# EAGLE design Arduino-Pro-Mini (EAGLE 8.2.1)
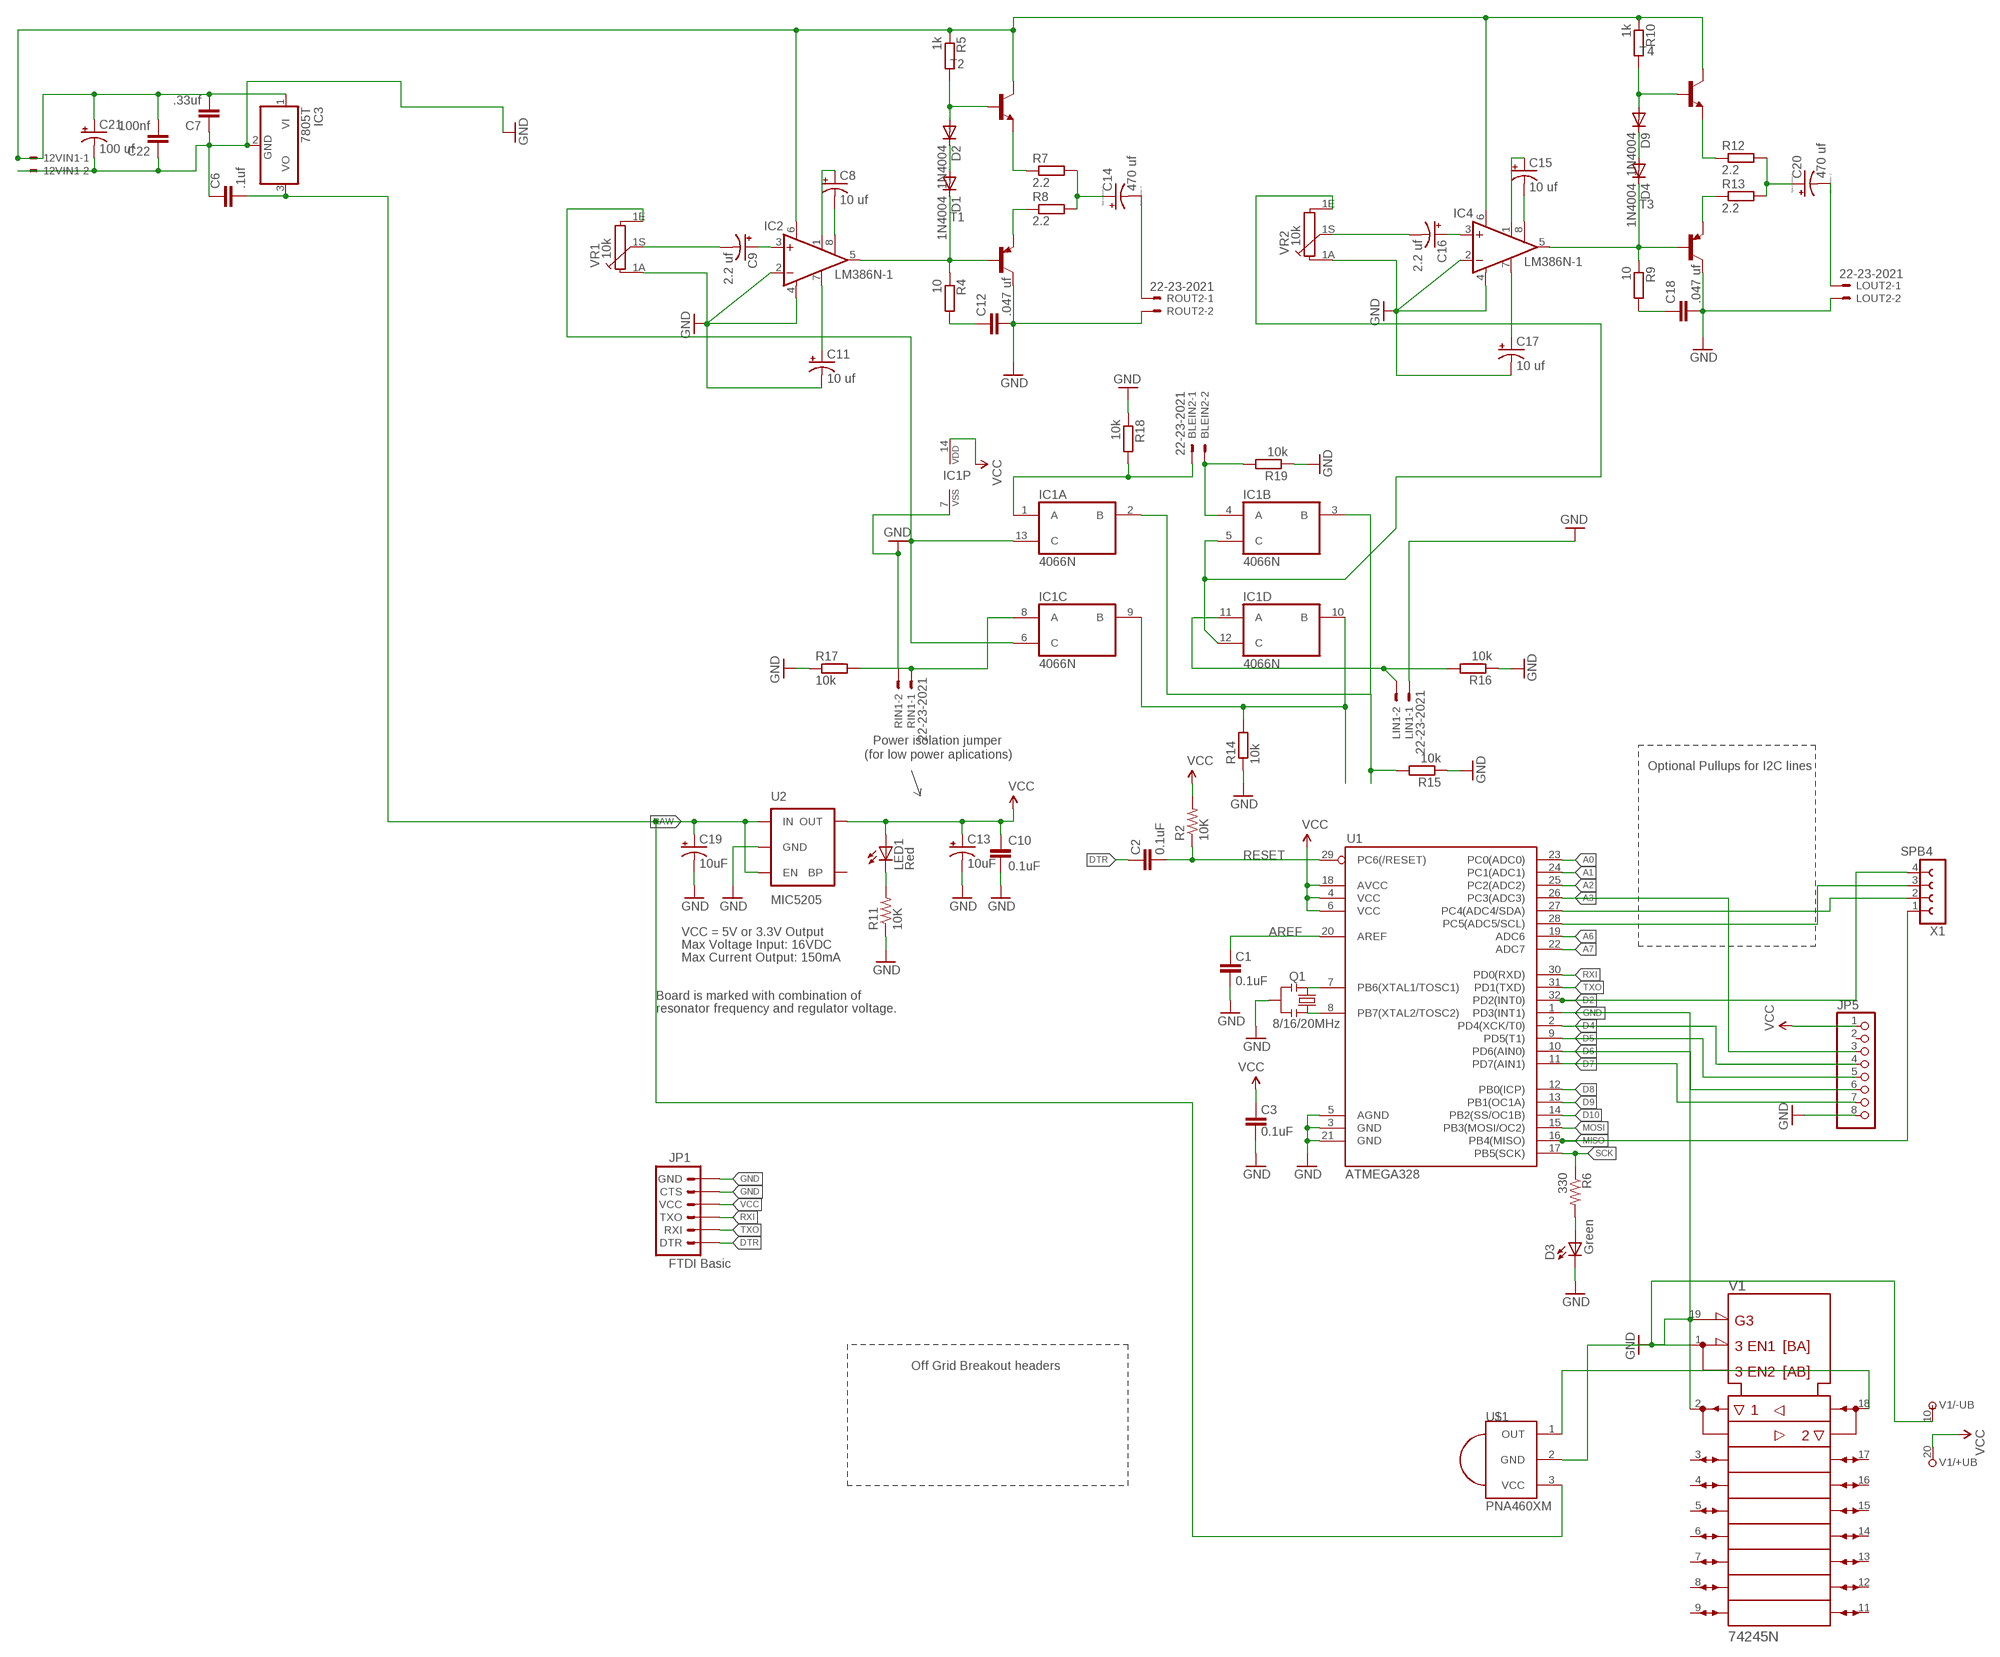
[diagram p0: schematic, sheet 1]

## Parts
12VIN1  22-23-2021  [22-23-2021]
BLEIN2  22-23-2021  [22-23-2021]
C1  0.1uF  CAPPTH1  [CAP-PTH-5MM]
C2  0.1uF  CAPPTH1  [CAP-PTH-5MM]
C3  0.1uF  CAPPTH1  [CAP-PTH-5MM]
C6  .1uf  C2.5/2  [C2.5-2]
C7  .33uf  C2.5/2  [C2.5-2]
C8  10 uf  CPOL-USE1.8-4  [E1,8-4]
C9  2.2 uf  CPOL-USE1.8-4  [E1,8-4]
C10  0.1uF  CAPPTH1  [CAP-PTH-5MM]
C11  10 uf  CPOL-USE1.8-4  [E1,8-4]
C12  .047 uf  C2.5/2  [C2.5-2]
C13  10uF  CAP_POLPTH1  [CPOL-RADIAL-100UF-25V]
C14  470 uf  CPOL-USE2,5-6E  [E2,5-6E]
C15  10 uf  CPOL-USE1.8-4  [E1,8-4]
C16  2.2 uf  CPOL-USE1.8-4  [E1,8-4]
C17  10 uf  CPOL-USE1.8-4  [E1,8-4]
C18  .047 uf  C2.5/2  [C2.5-2]
C19  10uF  CAP_POLPTH1  [CPOL-RADIAL-100UF-25V]
C20  470 uf  CPOL-USE2,5-6E  [E2,5-6E]
C21  100 uf  CPOL-USE1.8-4  [E1,8-4]
C22  100nf  C2.5/2  [C2.5-2]
D1  1N4004  [DO41-10]
D2  1N4004  [DO41-10]
D3  Green  LED5MM  [LED5MM]
D4  1N4004  [DO41-10]
D9  1N4004  [DO41-10]
IC1  4066N  [DIL14]
IC2  LM386N-1  [DIL08]
IC3  7805T  [TO220H]
IC4  LM386N-1  [DIL08]
JP1  FTDI Basic  ARDUINO_SERIAL_PROGRAMPTH  [1X06]
JP5  PINHD-1X8BIG  [1X08-BIG]
LED1  Red  LED5MM  [LED5MM]
LIN1  22-23-2021  [22-23-2021]
LOUT2  22-23-2021  [22-23-2021]
Q1  8/16/20MHz  RESONATORPTH  [RESONATOR-PTH]
R2  10K  RESISTORAXIAL-0.3  [AXIAL-0.3]
R4  10  R-EU_0204/7  [0204/7]
R5  1k  R-EU_0204/7  [0204/7]
R6  330  RESISTORAXIAL-0.3  [AXIAL-0.3]
R7  2.2  R-EU_0204/7  [0204/7]
R8  2.2  R-EU_0204/7  [0204/7]
R9  10  R-EU_0204/7  [0204/7]
R10  1k  R-EU_0204/7  [0204/7]
R11  10K  RESISTORAXIAL-0.3  [AXIAL-0.3]
R12  2.2  R-EU_0204/7  [0204/7]
R13  2.2  R-EU_0204/7  [0204/7]
R14  10k  R-EU_0204/7  [0204/7]
R15  10k  R-EU_0204/7  [0204/7]
R16  10k  R-EU_0204/7  [0204/7]
R17  10k  R-EU_0204/7  [0204/7]
R18  10k  R-EU_0204/7  [0204/7]
R19  10k  R-EU_0204/7  [0204/7]
RIN1  22-23-2021  [22-23-2021]
ROUT2  22-23-2021  [22-23-2021]
T1  -PNP-TO92  [TO92]
T2  -NPN-TO92  [TO92]
T3  -PNP-TO92  [TO92]
T4  -NPN-TO92  [TO92]
U1  ATMEGA328  ATMEGA168  [TQFP32-08]
U2  MIC5205  V_REG_LDOSMD  [SOT23-5]
U$1  PNA460XM  [PNA460XM]
V1  74245N  [DIL20]
VR1  10k  PC16S  [PC16S]
VR2  10k  PC16S  [PC16S]
X1  SPB4  [SPB4]

## Nets
3.3V: IC1.14(P:VDD) JP5.1 V1.20(+UB) ; supply symbol labelled VCC
A0: U1.23(PC0(ADC0))
A1: U1.24(PC1(ADC1))
A2: U1.25(PC2(ADC2))
A3: JP5.3 U1.26(PC3(ADC3))
A4: U1.27(PC4(ADC4/SDA)) X1.2
A5: U1.28(PC5(ADC5/SCL)) X1.3
A6: U1.19(ADC6)
A7: U1.22(ADC7)
AREF: C1.2 U1.20(AREF)
D2: U1.32(PD2(INT0)) X1.4
D4: JP5.4 U1.2(PD4(XCK/T0))
D5: JP5.5 U1.9(PD5(T1))
D6: JP5.6 U1.10(PD6(AIN0))
D7: JP5.7 U1.11(PD7(AIN1))
D8: U1.12(PB0(ICP))
D9: U1.13(PB1(OC1A))
D10: U1.14(PB2(SS/OC1B))
DTR: C2.2 JP1.1(DTR)
GND [vcc]: 12VIN1.2 C1.1 C3.1 C6.1 C7.1 C10.2 C11.- C12.2 C13.2(-) C17.- C18.2 C19.2(-) C21.- C22.1 D3.K(C) IC1.7(P:VSS) IC2.2(-IN) IC2.4(GND) IC3.2(GND) IC4.2(-IN) IC4.4(GND) JP1.5(CTS) JP1.6(GND) JP5.8 LIN1.1 LOUT2.2 Q1.2 R11.P$1 R14.1 R15.1 R16.1 R17.1 R18.1 R19.1 RIN1.2 ROUT2.2 T1.3(C) T3.3(C) U1.1(PD3(INT1)) U1.3(GND) U1.5(AGND) U1.21(GND) U2.2(GND) U$1.2(GND) V1.1(DIR) V1.2(A1) V1.10(-UB) VR1.1A VR2.1A
MISO: U1.16(PB4(MISO)) X1.1
MOSI: U1.15(PB3(MOSI/OC2))
N$1: Q1.3 U1.8(PB7(XTAL2/TOSC2))
N$2: Q1.1 U1.7(PB6(XTAL1/TOSC1))
N$4: LED1.K(C) R11.P$2
N$5: BLEIN2.2 IC1.4(B:A) R19.2
N$6: IC1.6(C:C) IC1.13(A:C) VR1.1E
N$7: D3.A R6.P$2
N$8: C8.- IC2.8(GAIN)
N$9: C8.+ IC2.1(GAIN)
N$10: C9.+ IC2.3(+IN)
N$11: C9.- VR1.1S
N$12: C11.+ IC2.7(BYPASS)
N$13: D1.C IC2.5(OUT) R4.1 T1.2(B)
N$14: C12.1 R4.2
N$15: D1.A D2.C
N$16: D2.A R5.2 T2.2(B)
N$17: R8.1 T1.1(E)
N$18: R7.1 T2.1(E)
N$19: C14.+ R7.2 R8.2
N$20: C14.- ROUT2.1
N$21: 12VIN1.1 C7.2 C21.+ C22.2 IC2.6(VS) IC3.1(VI) IC4.6(VS) R5.1 R10.1 T2.3(C) T4.3(C)
N$22: C15.- IC4.8(GAIN)
N$23: C15.+ IC4.1(GAIN)
N$24: C16.+ IC4.3(+IN)
N$25: C16.- VR2.1S
N$26: C17.+ IC4.7(BYPASS)
N$27: D4.C IC4.5(OUT) R9.1 T3.2(B)
N$28: C18.1 R9.2
N$29: D4.A D9.C
N$30: D9.A R10.2 T4.2(B)
N$31: R13.1 T3.1(E)
N$32: R12.1 T4.1(E)
N$33: C20.+ R12.2 R13.2
N$34: IC1.8(C:A) R17.2 RIN1.1
N$35: C20.- LOUT2.1
N$36: IC1.5(B:C) IC1.12(D:C) VR2.1E
N$37: BLEIN2.1 IC1.1(A:A) R18.2
N$38: IC1.11(D:A) LIN1.2 R16.2
N$39: U$1.1(OUT) V1.18(B1)
N$40: IC1.9(C:B) IC1.10(D:B) R14.2
N$41: IC1.2(A:B) IC1.3(B:B) R15.2
RAW [vcc]: C6.2 C19.1(+) IC3.3(VO) U2.1(IN) U2.3(EN) U$1.3(VCC)
RESET: C2.1 R2.P$1 U1.29(PC6(/RESET))
RXI: JP1.3(TXO) U1.30(PD0(RXD))
SCK: R6.P$1 U1.17(PB5(SCK))
TXO: JP1.2(RXI) U1.31(PD1(TXD))
VCC: C3.2 C10.1 C13.1(+) JP1.4(VCC) LED1.A R2.P$2 U1.4(VCC) U1.6(VCC) U1.18(AVCC) U2.5(OUT)
Unconnected: JP5.2 U2.4(BP) V1.3(A2) V1.4(A3) V1.5(A4) V1.6(A5) V1.7(A6) V1.8(A7) V1.9(A8) V1.11(B8) V1.12(B7) V1.13(B6) V1.14(B5) V1.15(B4) V1.16(B3) V1.17(B2) V1.19(!G)

## Notes on the sheet
- Power isolation jumper
- (for low power aplications)
- Optional Pullups for I2C lines
- VCC = 5V or 3.3V Output
- Max Voltage Input: 16VDC
- Max Current Output: 150mA
- Board is marked with combination of
- resonator frequency and regulator voltage.
- Off Grid Breakout headers

## Library data of the parts
12VIN1 BLEIN2 LIN1 LOUT2 RIN1 ROUT2 = con-molex:22-23-2021: .100" (2.54mm) Center Header - 2 Pin; MF: MOLEX; MPN: 22-23-2021; OC_FARNELL: 1462926; OC_NEWARK: 25C3832
C1-C3 C10 = SparkFun:CAP: Capacitor Standard 0603 ceramic capacitor, and 0.1" leaded capacitor.
C6 C7 C12 C18 C22 = capacitor-wima:C: CAPACITOR naming: grid - package width
C8 C9 C11 C15-C17 C21 = rcl:CPOL-US: POLARIZED CAPACITOR, American symbol
C13 C19 = SparkFun:CAP_POL: Capacitor Polarized These are standard SMD and PTH capacitors. Normally 10uF, 47uF, and 100uF in electrolytic and tantalum varieties. Always verify the external diameter of the through hole cap, it varies with capacity, voltage, and manufacturer. The EIA devices should be standard.
C14 C20 = resistor:CPOL-US: POLARIZED CAPACITOR, American symbol
D1 D2 D4 D9 = diode:1N4004: DIODE general purpose rectifier, 1 A
D3 LED1 = Testing:LED: LEDs Standard schematic elements and footprints for 5mm, 3mm, 1206, and 0603 sized LEDs. 5mm - Spark Fun Electronics SKU : COM-00529 (and others)
IC1 = 40xx:4066: Quad bilateral ANALOG SWITCH
IC2 IC4 = linear:LM386?-*: Low Voltage Audio Power Amplifier Source: http://cache.national.com/ds/LM/LM386.pdf
IC3 = linear:78*: Positive VOLTAGE REGULATOR Source: http://cache.national.com/ds/LM/LM78L05.pdf http://www.fairchildsemi.com/ds/LM/LM7805.pdf
JP1 = SparkFun:ARDUINO_SERIAL_PROGRAM
JP5 = adafruit:PINHD-1X8: PIN HEADER
Q1 = Testing:RESONATOR: Resonator Small SMD resonator. This is the itty bitty 10/20MHz resonators with built in caps. CSTCE10M0G55 and CSTCE20M0V53. Footprint for SMD has been used in SFE production for years, and does work okay. 1:1 is an attempt to get larger fillets on the sides so it will be easier to inspect these solders in our AOI machine. The pads have been minimized to match the actual metal under the resonator. To see this relation, it includes an image import of the bottom side of the component. Imported to scale on layer 200.
R2 R6 R11 = SparkFun:RESISTOR: Resistor Basic schematic elements and footprints for 0603, 1206, and PTH resistors.
R4 R5 R7-R10 R12-R19 = rcl:R-EU_: RESISTOR, European symbol
T1 T3 = transistor:*-PNP-: PNP Transistror
T2 T4 = transistor:*-NPN-: NPN Transistror BF959 corrected 2008.03.06
U1 = SparkFun:ATMEGA168
U2 = SparkFun:V_REG_LDO: Voltage Regulator LDO Standard 150mA LDO voltage regulator in SOT-23 layout. Micrel part MIC5205. BP (by-pass) pin is used to lower output noise with 470pF cap.
U$1 = adafruit:PNA460XM: IR 38KHz receiver PNA4602 and related receivers http://www.ladyada.net/library/pcb/eaglelibrary.html
V1 = 74ttl-din:74*245: Octal BUS TRANSCEIVER, 3-state
VR1 VR2 = piher:PC16S: POTENTIOMETER single carbon potentiometer, 16 mm, S3ROH; OC_FARNELL: 4452940; OC_NEWARK: unknown
X1 = con-hirschmann:SPB4: CONNECTOR 4 pins; OC_FARNELL: unknown; OC_NEWARK: unknown

## Net classes
1 vcc: width 0.254 mm

## Board
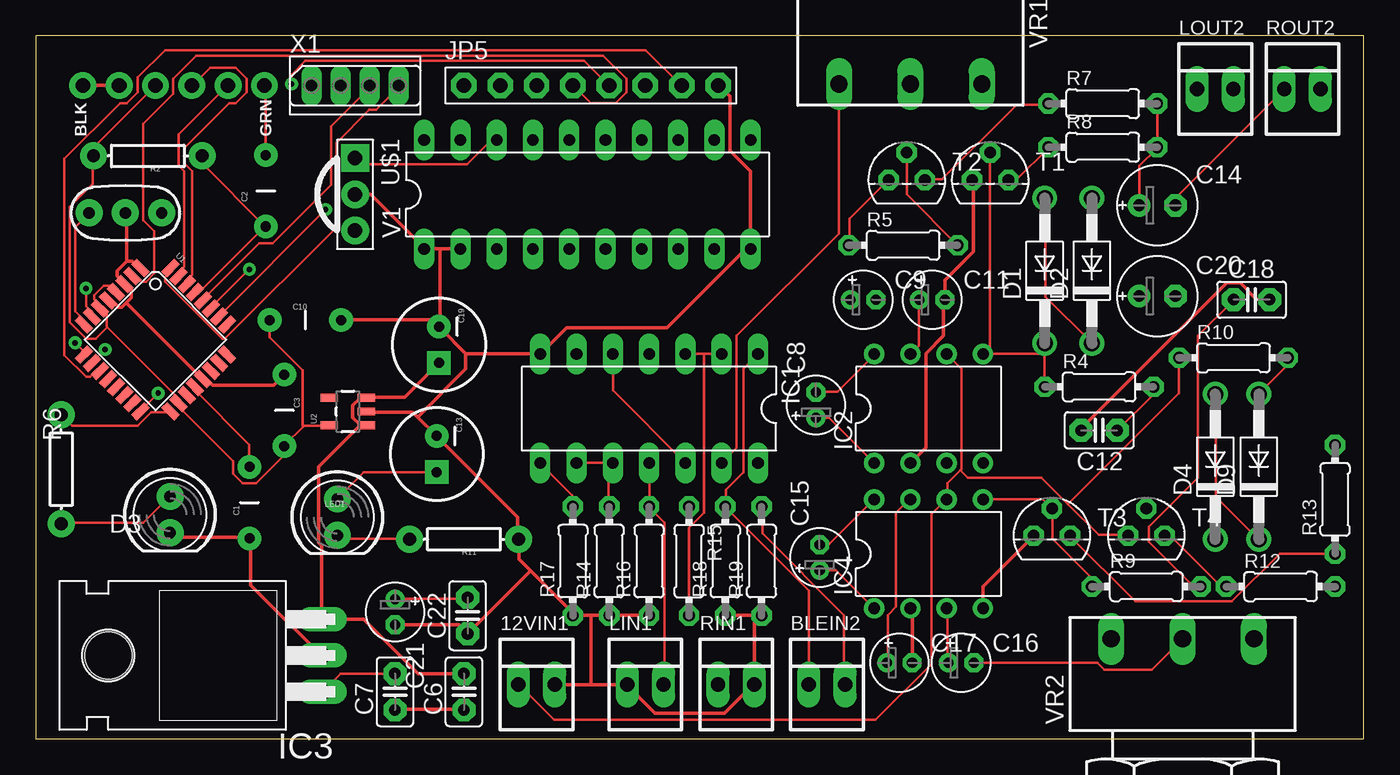
[diagram p1: board, top side]
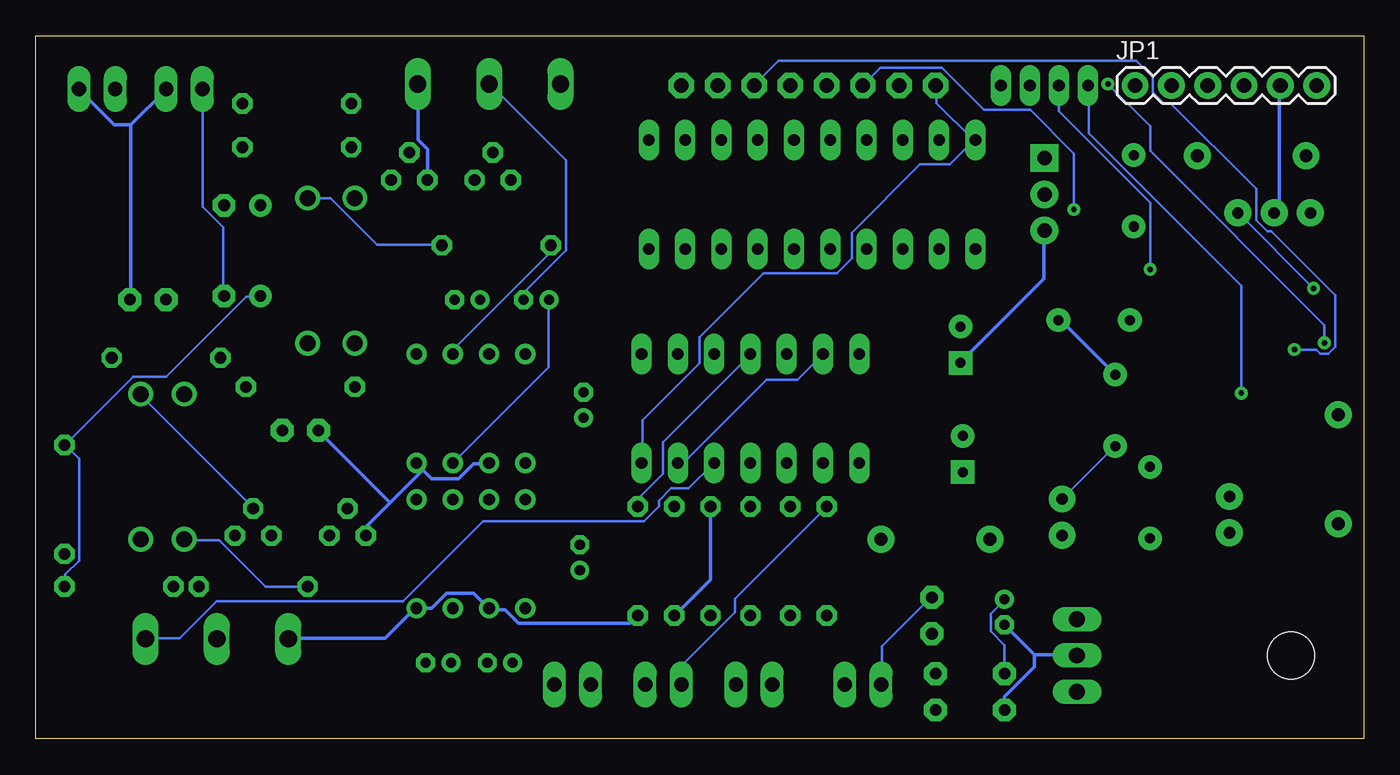
[diagram p2: board, bottom side, seen from below]

Size 92.94 x 49.2 mm. Coordinates in mm from the lower left corner, seen from the top.
Outline: 0,0 92.94,0 92.94,49.2 0,49.2 0,0
Copper layers (1*16): Top 0.035mm / dielectric 1.5mm / Bottom 0.035mm
Design rules "SparkFun-2-layer *": minimum track width 7mil, minimum drill 15mil, track to track 8mil, track to pad 8mil, pad to pad 8mil, via to via 8mil, smd to smd 8mil, copper to edge 8mil, drill to drill 8mil, minimum pad ring 12mil, minimum via ring 10mil, stop-mask expansion 4mil, vias tented up to drill 20mil, thermal gap 10mil

### Footprints (pad centres in the part's own frame; a part is rotated, then mirrored left to right if it is on the bottom)
22-23-2021 = drill 1 long: 1 -1.27,0; 2 1.27,0
CAP-PTH-5MM = drill 0.7 pad 1.651: 1 -2.5,0; 2 2.5,0
C2.5-2 = drill 0.813 pad 1.6 octagon: 1 -1.27,0; 2 1.27,0
E1,8-4 = drill 0.711 pad 1.168: + -0.889,0 | drill 0.711 pad 1.168 octagon: - 0.889,0
CPOL-RADIAL-100UF-25V = drill 0.7 pad 1.651 square: 1 1.27,0 | drill 0.7 pad 1.651: 2 -1.27,0
E2,5-6E = drill 0.813 pad 1.575: + -1.27,0 | drill 0.813 pad 1.575 octagon: - 1.27,0
DO41-10 = drill 1.118: A 5.08,0; C -5.08,0
LED5MM = drill 0.813 pad 1.88: A -1.27,0; K 1.27,0
DIL14 = drill 0.813 long: 1 -7.62,-3.81; 2 -5.08,-3.81; 3 -2.54,-3.81; 4 0,-3.81; 5 2.54,-3.81; 6 5.08,-3.81; 7 7.62,-3.81; 8 7.62,3.81; 9 5.08,3.81; 10 2.54,3.81; 11 0,3.81; 12 -2.54,3.81; 13 -5.08,3.81; 14 -7.62,3.81
DIL08 = drill 0.813 pad 1.27: 1 -3.81,-3.81; 2 -1.27,-3.81; 3 1.27,-3.81; 4 3.81,-3.81; 5 3.81,3.81; 6 1.27,3.81; 7 -1.27,3.81; 8 -3.81,3.81
TO220H = drill 1.118 long: 1 -2.54,-10.16; 2 0,-10.16; 3 2.54,-10.16 | hole 3.302: 0,4.826
1X06 = drill 1.016 pad 1.88: 1 0,0; 2 2.54,0; 3 5.08,0; 4 7.62,0; 5 10.16,0; 6 12.7,0
1X08-BIG = drill 1.016 pad 1.778 octagon: 1 -8.89,0; 2 -6.35,0; 3 -3.81,0; 4 -1.27,0; 5 1.27,0; 6 3.81,0; 7 6.35,0; 8 8.89,0
RESONATOR-PTH = drill 0.8 pad 1.88: 1 -2.54,0; 2 0,0; 3 2.54,0
AXIAL-0.3 = drill 0.9 pad 1.88: P$1 -3.81,0; P$2 3.81,0
0204/7 = drill 0.813 octagon: 1 -3.81,0; 2 3.81,0
TO92 = drill 0.813 octagon: 1 1.27,0; 2 0,1.905; 3 -1.27,0
TQFP32-08 = smd 1.27 x 0.559: 1 -4.293,2.8; 2 -4.293,2; 3 -4.293,1.2; 4 -4.293,0.4; 5 -4.293,-0.4; 6 -4.293,-1.2; 7 -4.293,-2; 8 -4.293,-2.8; 17 4.293,-2.8; 18 4.293,-2; 19 4.293,-1.2; 20 4.293,-0.4; 21 4.293,0.4; 22 4.293,1.2; 23 4.293,2; 24 4.293,2.8 | smd 0.559 x 1.27: 9 -2.8,-4.293; 10 -2,-4.293; 11 -1.2,-4.293; 12 -0.4,-4.293; 13 0.4,-4.293; 14 1.2,-4.293; 15 2,-4.293; 16 2.8,-4.293; 25 2.8,4.293; 26 2,4.293; 27 1.2,4.293; 28 0.4,4.293; 29 -0.4,4.293; 30 -1.2,4.293; 31 -2,4.293; 32 -2.8,4.293
SOT23-5 = smd 0.55 x 1.2: 1 -0.95,-1.3; 2 0,-1.3; 3 0.95,-1.3; 4 0.95,1.3; 5 -0.95,1.3
PNA460XM = drill 1.016 pad 1.93 square: 1 -2.54,0 | drill 1.016 pad 1.93: 2 0,0; 3 2.54,0
DIL20 = drill 0.813 long: 1 -11.43,-3.81; 2 -8.89,-3.81; 3 -6.35,-3.81; 4 -3.81,-3.81; 5 -1.27,-3.81; 6 1.27,-3.81; 7 3.81,-3.81; 8 6.35,-3.81; 9 8.89,-3.81; 10 11.43,-3.81; 11 11.43,3.81; 12 8.89,3.81; 13 6.35,3.81; 14 3.81,3.81; 15 1.27,3.81; 16 -1.27,3.81; 17 -3.81,3.81; 18 -6.35,3.81; 19 -8.89,3.81; 20 -11.43,3.81
PC16S = drill 1.2 long: 1A -5,6.5; 1E 5,6.5; 1S 0,6.5
SPB4 = drill 0.813 long: 1 -3.048,0; 2 -1.016,0; 3 1.016,0; 4 3.048,0

### Placement (x,y rotation side)
12VIN1  35.05,3.81 0 top
BLEIN2  55.37,3.81 0 top
C1  14.96,16.54 90 top
C2  16.1,38.35 90 top
C3  17.4,22.99 270 top
C6  29.97,3.3 90 top
C7  25.15,3.3 90 top
C8  54.61,23.37 90 top
C9  57.91,30.73 0 top
C10  18.87,29.31 0 top
C11  62.74,30.73 0 top
C12  74.42,21.59 180 top
C13  28.07,19.94 270 top
C14  78.49,37.34 0 top
C15  54.86,12.7 90 top
C16  64.77,5.33 0 top
C17  60.45,5.33 0 top
C18  85.09,30.73 0 top
C19  28.22,27.58 270 top
C20  78.49,30.99 0 top
C21  25.15,8.89 270 top
C22  30.23,8.64 90 top
D1  70.61,32.77 90 top
D2  73.91,32.77 90 top
D3  9.4,15.7 270 top
D4  82.55,19.05 90 top
D9  85.6,19.05 90 top
IC1  42.93,23.11 180 top
IC2  62.48,23.11 0 top
IC3  9.91,5.84 90 top
IC4  62.48,12.95 0 top
JP1  16,45.72 0 bottom
JP5  38.86,45.72 0 top
LED1  21.11,15.52 270 top
LIN1  42.67,3.81 0 top
LOUT2  82.55,45.47 0 top
Q1  6.27,36.8 180 top
R2  7.85,40.79 180 top
R4  74.42,24.64 0 top
R5  60.71,34.54 0 top
R6  1.78,18.87 270 top
R7  74.68,44.45 0 top
R8  74.68,41.4 0 top
R9  77.72,10.67 0 top
R10  83.82,26.67 0 top
R11  29.97,13.97 180 top
R12  87.12,10.67 0 top
R13  90.93,16.76 90 top
R14  40.13,12.45 90 top
R15  45.72,12.45 270 top
R16  42.93,12.45 90 top
R17  37.59,12.45 90 top
R18  48.26,12.45 90 top
R19  50.8,12.45 90 top
RIN1  49.02,3.81 0 top
ROUT2  88.65,45.47 0 top
T1  66.8,39.12 0 top
T2  60.96,39.12 0 top
T3  71.12,14.22 0 top
T4  77.72,14.22 0 top
U1  8.38,27.94 315 top
U2  21.84,22.91 90 top
U$1  22.35,38.1 270 top
V1  38.61,38.1 0 top
VR1  61.21,52.32 180 top
VR2  80.26,0.51 0 top
X1  22.35,45.72 0 top

### Tracks (layer width: path | path; a pad name or v marks a point on that pad's centre or on a via)
3.3V
  Bottom 0.178: IC1.14 50.48,19.34 50.48,22.29 46.48,26.29 46.48,28.1 42,32.58 36.86,32.58 35.81,33.62 35.81,35.43 31.05,40.2 28.96,40.2 27.24,41.91 V1.20 27.34,41.91 29.91,44.48 29.91,45.72 JP5.1
A3  (via drill 0.38)
  Top 0.178: v20.29,37.05 12.86,29.62 U1.26
  Bottom 0.178: v20.29,37.05 20.29,40.96 23.34,44.01 26.58,44.01 29.53,46.96 33.81,46.96 JP5.3
A4  (via drill 0.38)
  Top 0.178: v14.95,32.86 12.29,30.19 U1.27
  Bottom 0.178: v14.95,32.86 14.95,37.53 21.34,43.91 X1.2
A5
  Top 0.178: U1.28 11.72,30.77 15.62,34.67 16.57,34.67 20.67,38.77 20.67,42.86 23.34,45.53 23.34,45.72 X1.3
AREF
  Top 0.178: U1.20 11.14,24.57 11.14,24.38 14.95,20.57 C1.2
D2
  Top 0.178: U1.32 9.43,32.86 9.43,32.67 9.05,32.29 9.05,32 13.05,28 13.24,28 21.05,35.81 21.05,41.72 23.34,44.01 23.81,44.01 25.34,45.53 25.34,45.72 X1.4
D4
  Top 0.178: U1.2 7.05,32.38 7.43,32 7.72,32 8.29,32.58 8.29,35.53 7.53,36.29 7.53,43.05 9.62,45.15 9.62,46.2 11.24,47.81 39.72,47.81 41.34,46.2 41.34,45.24 40.58,44.48 38.86,44.48 37.62,45.72 JP5.4
D5  (via drill 0.38)
  Top 0.178: v2.76,27.72 3.33,27.15 3.33,26.96 U1.9 | v17.91,45.81 17.91,46.48 18.86,47.43 38.39,47.43 40.1,45.72 JP5.5
  Bottom 0.178: v2.76,27.72 2.76,28.96 14.95,41.15 14.95,42.86 v17.91,45.81
D6  (via drill 0.38)
  Top 0.178: v4.86,27.24 4,26.38 U1.10
  Bottom 0.178: v4.86,27.24 3.33,27.24 3.05,26.96 2.48,26.96 2,27.43 2,31.05 6.48,35.53 6.76,35.53 7.53,36.29 7.53,38.48 13.53,44.48 14,44.48 14.76,45.24 14.76,46.29 15.91,47.43 40.96,47.43 JP5.6
D7
  Top 0.178: U1.11 4.48,25.72 4.19,25.72 3.81,25.34 3.52,25.34 2,26.86 2,40.58 5.91,44.48 6.38,44.48 7.14,45.24 7.14,46.29 9.05,48.2 42.67,48.2 45.15,45.72 JP5.7
DTR
  Top 0.178: JP1.1 16.1,45.62 16.1,40.86 C2.2
GND
  Top 0.254: T1.3 65.53,39.05 65.63,38.96 65.63,34.1 63.63,32.1 C11.- 63.53,30.67 63.53,28.19 62.29,26.96 62.29,20.38 IC2.2 | C17.- 61.34,9.05 61.25,9.14 IC4.2 | IC4.4 66.29,10.67 T3.3 | C12.2 73.15,21.72 83.34,31.91 84.3,31.91 85.44,30.77 86.3,30.77 C18.2 | R18.1 48.29,8.67 50.77,8.67 R19.1 50.29,8.57 RIN1.2 50.2,3.81 48.2,1.81 43.34,1.81 41.43,3.72 LIN1.1 38.86,3.81 | 38.86,3.81 12VIN1.2 | 38.86,8.67 40.1,8.67 R14.1 40.2,8.67 42.86,8.67 R16.1 | 38.86,8.67 37.62,8.67 R17.1 37.62,8.76 34.62,11.76 | 34.62,11.76 33.81,12.57 33.81,13.91 R11.P$1 33.72,14 33.72,15.53 28.1,21.15 C13.2 28,21.24 26.72,22.53 | 38.86,8.67 38.86,3.81 | D3.K 9.43,14.38 9.72,14.1 14.95,14.1 C1.1 15.05,14 15.05,10.76 20,5.81 IC3.2 | C7.1 25.15,2.1 29.91,2.1 C6.1 | C21.- 29.62,8 30.19,7.43 C22.1 34.62,11.76 | JP1.5 JP1.6 | 6.33,30.53 6.67,30.86 6.67,31.43 6.29,31.81 U1.3 6.19,31.91 5.72,32.38 5.72,32.77 6.38,33.43 | 6.33,30.53 6,30.19 5.81,30.19 5.33,30.67 5.14,30.67 U1.5 | 6.38,33.43 6.76,33.43 7.24,32.96 U1.1 | 6.38,33.43 6.38,36.67 6.29,36.77 Q1.2 | JP5.8 47.81,45.72 48.58,44.96 48.58,41.15 50.01,39.72 50.01,34.29 V1.10 49.72,34.29 44.2,28.77 37.15,28.77 IC1.7 35.24,26.96 30.1,26.96 | C3.1 17.33,25.43 16.67,24.77 12.38,24.77 12,25.15 11.72,25.15 U1.21 11.62,25.24 6.33,30.53 | 26.72,22.53 26.38,22.86 23.15,22.86 U2.2 | V1.2 28.29,34.29 | 28.29,34.29 V1.1 27.15,34.38 23.43,38.1 U$1.2 | 30.1,26.96 28.29,28.77 C19.2 | 28.29,34.29 28.29,28.96 C19.2 | 26.72,22.53 30.1,25.91 30.1,26.96 | C10.2 21.43,29.34 28.19,29.34 C19.2
  Bottom 0.254: 86.3,42.96 86.3,30.77 C18.2 | 86.3,42.96 83.82,45.43 LOUT2.2 | 86.3,42.96 87.44,42.96 89.92,45.43 ROUT2.2 | T1.3 65.53,41.24 66.2,41.91 66.2,45.81 VR1.1A | VR2.1A 75.25,7.05 68.48,7.05 66.39,9.14 IC4.4 65.25,9.14 64.2,10.19 62.29,10.19 61.25,9.14 IC4.2 61.15,9.05 60.1,9.05 59.15,8.1 51.34,8.1 R19.1 | IC2.2 61.25,19.24 62.29,19.24 63.34,18.19 65.25,18.19 66.29,19.24 IC2.4 65.91,18.76 68.15,16.53 | 68.15,16.53 69.82,14.86 69.82,14.29 T3.3 | 68.15,16.53 73.15,21.53 C12.2 | R15.1 45.72,11.14 48.2,8.67 R18.1 | 23.05,5.91 20.1,5.91 IC3.2 | C21.- 23.05,5.91 | C7.1 25.15,2.95 23.05,5.05 23.05,5.91 | JP1.5 5.91,45.72 5.91,37.15 6.19,36.86 Q1.2 | C10.2 21.34,29.24 21.14,29.24 17.43,25.53 C3.1
MISO  (via drill 0.38)
  Top 0.178: v8.57,24.19 7.33,22.95 U1.16
  Bottom 0.178: v8.57,24.19 8.57,31.72 19.24,42.39 19.24,45.72 X1.1
N$1
  Top 0.178: U1.8 3.33,29.05 3.33,29.34 2.76,29.91 2.76,35.81 3.72,36.77 Q1.3
N$2  (via drill 0.38)
  Top 0.178: v3.52,31.53 3.52,30.29 3.91,29.91 3.91,29.62 U1.7
  Bottom 0.178: v3.52,31.53 8.76,36.77 Q1.1
N$4
  Top 0.178: R11.P$2 26.1,14 21.34,14 21.14,14.19 LED1.K
N$5
  Top 0.178: BLEIN2.2 56.58,3.81 56.58,8.67 50.86,14.38 50.86,16.19 R19.2
  Bottom 0.178: R19.2 50.77,16.29 50.77,16.86 49.05,18.57 49.05,20.76 42.96,26.86 IC1.4
N$6
  Top 0.178: VR1.1E 56.2,45.81 56.2,35.34 49.05,28.19 49.05,20.38 48.01,19.34 IC1.13
  Bottom 0.178: IC1.6 39.62,25.15 41.81,25.15 47.62,19.34 48.01,19.34 IC1.13
N$7
  Top 0.178: R6.P$2 1.81,15.15 7.53,15.15 9.33,16.95 D3.A
N$8
  Top 0.178: C8.- 54.67,24.29 56.1,24.29 58.67,26.86 IC2.8
N$9
  Top 0.178: C8.+ 55.53,22.48 58.67,19.34 IC2.1
N$10
  Bottom 0.178: IC2.3 57.06,26 57.06,30.67 C9.+
N$11
  Bottom 0.178: C9.- 58.77,30.77 58.77,31.24 55.82,34.2 55.82,40.48 61.15,45.81 VR1.1S
N$12
  Top 0.178: IC2.7 61.82,27.53 61.82,30.67 C11.+
N$13
  Top 0.178: 70.58,26.96 70.58,27.62 D1.C 70.58,26.96 | 70.58,26.96 70.58,24.67 R4.1 | 70.58,26.96 66.77,26.96 | 66.77,26.96 66.29,26.96 IC2.5 66.77,26.96 | 66.77,26.96 66.77,40.96 T1.2
N$14
  Top 0.178: C12.1 78.2,24.1 78.2,24.57 R4.2
N$15
  Top 0.178: D1.A 70.68,37.81 70.68,30.96 73.91,27.72 D2.C
N$16
  Top 0.178: T2.2 60.96,38.1 R5.2
  Bottom 0.178: D2.A 73.91,37.81 72.3,37.81 69.06,34.58 64.58,34.58 R5.2
N$17
  Top 0.178: T1.1 68.1,39.15 68.67,39.15 70.87,41.34 R8.1
N$18
  Top 0.178: T2.1 62.29,39.15 63.44,39.15 68.67,44.39 70.87,44.39 R7.1
N$19
  Top 0.178: R7.2 R8.2 78.49,41.34 77.25,40.1 77.25,37.34 C14.+
N$20
  Top 0.178: ROUT2.1 79.82,37.91 79.82,37.34 C14.-
N$21
  Top 0.178: C7.2 21.34,4.57 IC3.1 | C21.+ 25.15,9.81 30.1,9.81 30.19,9.91 C22.2 | T2.3 56.96,36.38 56.96,34.58 R5.1 | 64.72,18.81 64.77,18.86 64.77,25.91 IC2.6 | 64.72,18.81 63.82,17.91 63.82,16.76 IC4.6 63.72,16.76 62.67,15.72 62.67,5.24 58.77,1.33 36.29,1.33 33.81,3.81 12VIN1.1 | 72.25,16.43 70.39,18.29 65.25,18.29 64.72,18.81 | 72.25,16.43 74.39,14.29 76.39,14.29 T4.3 | R10.1 80.01,24.19 72.25,16.43
  Bottom 0.178: 12VIN1.1 33.72,3.81 33.72,6.48 30.29,9.91 C22.2 | C7.2 25.15,6.57 26.1,7.53 26.1,8.76 25.15,9.72 C21.+ | R5.1 56.96,34.48 56.96,34 63.72,27.24 63.72,26.96 IC2.6
N$22
  Top 0.178: IC4.8 55.53,13.62 54.86,13.62 C15.-
N$23
  Top 0.178: C15.+ 56.01,11.81 IC4.1
N$24
  Top 0.178: C16.+ 63.82,5.33 63.82,9.14 IC4.3
N$25
  Top 0.178: C16.- 74.3,5.33 74.77,4.86 78.11,4.86 80.2,6.95 VR2.1S
N$26
  Top 0.178: C17.+ 59.63,5.33 59.63,8.67 60.2,9.24 60.2,15.81 61.15,16.76 IC4.7
N$27
  Top 0.178: IC4.5 70.48,16.76 T3.2 71.15,16.1 71.15,14 73.91,11.24 R9.1
  Bottom 0.178: R9.1 76.87,10.67 80.11,13.91 82.49,13.91 D4.C
N$28
  Top 0.178: R9.2 81.06,10.67 77.91,13.81 77.91,14.86 81.34,18.29 81.34,28.19 83.82,30.67 C18.1
N$29
  Top 0.178: D4.A 82.58,24.1 82.58,16.95 85.53,14 D9.C
N$30
  Top 0.178: R10.2 87.63,26.19 85.63,24.19 D9.A
  Bottom 0.178: T4.2 77.72,16.19 85.63,24.1 D9.A
N$31
  Top 0.178: R13.1 87.06,12.95 83.73,9.62 76.96,9.62 72.39,14.19 T3.1
N$32
  Top 0.178: R12.1 82.96,10.67 79.44,14.19 79.06,14.19 T4.1
N$33
  Bottom 0.178: 90.87,20.57 89.92,19.62 89.92,12.48 90.87,11.52 90.87,10.67 R12.2 | 90.87,20.57 86.11,25.34 83.82,25.34 78.2,30.96 77.25,30.96 C20.+ | 90.87,20.57 R13.2
N$34
  Top 0.178: R17.2 37.53,16.29 37.53,17.05 35.34,19.24 IC1.8
  Bottom 0.178: RIN1.1 47.72,3.81 47.72,5.14 44,8.86 44,9.81 37.62,16.19 R17.2
N$35
  Bottom 0.178: C20.- 79.82,31.05 79.82,35.81 81.25,37.24 81.25,45.43 LOUT2.1
N$36
  Top 0.178: IC1.5 40.39,24.38 IC1.12
  Bottom 0.178: IC1.12 47.24,17.53 48.48,17.53 49.34,16.67 49.34,16.29 50.39,15.24 61.63,15.24 67.25,9.62 80.3,9.62 82.87,7.05 85.25,7.05 VR2.1E
N$37
  Top 0.178: IC1.1 49.53,25.91 49.53,18.67 48.29,17.43 48.29,16.29 R18.2 48.29,16.19 54.1,10.38 BLEIN2.1
N$38
  Top 0.178: IC1.11 42.96,19.24 42.96,16.29 R16.2 42.96,16.19 44,15.15 44,3.81 LIN1.2
N$39
  Top 0.178: V1.18 31.91,41.91 30.19,40.2 22.77,40.2 22.38,40.58 U$1.1
N$40
  Top 0.178: 40.1,19.34 40.39,19.34 IC1.10 40.1,19.34 | 40.1,19.34 37.91,19.34 IC1.9 | 40.1,19.34 40.1,16.29 R14.2
N$41
  Top 0.178: 46.77,26.96 48.01,26.96 IC1.2 | 46.77,26.96 45.53,26.96 IC1.3 | R15.2 45.72,14.76 46.77,15.81 46.77,26.96
RAW
  Top 0.254: C6.2 26.77,4.57 22.95,8.38 IC3.3 20,8.48 20,13.53 19.81,13.72 19.81,19.05 22.67,21.91 U2.1 23.05,22 22.67,22 22.19,22.48 22.19,23.34 22.67,23.81 23.05,23.81 U2.3 23.24,23.91 25.81,23.91 C19.1
  Bottom 0.254: U$1.3 22.38,35.53 22.38,32.19 28.19,26.38 C19.1
RESET
  Top 0.178: U1.29 11.14,31.34 11.53,31.34 16.1,35.91 C2.1 16,35.91 11.72,40.2 11.72,40.77 R2.P$1
RXI
  Top 0.178: U1.30 10.57,31.91 10.57,32.1 10.95,32.48 10.95,39.72 10.38,40.29 10.38,41.34 13.53,44.48 14,44.48 14.76,45.24 14.76,46.2 14,46.96 12.19,46.96 10.95,45.72 JP1.3
SCK
  Top 0.178: U1.17 9.43,22.86 8.1,22.86 7.14,21.91 2.57,21.91 1.81,22.67 R6.P$1
TXO
  Top 0.178: U1.31 10.1,32.48 10.1,32.77 10.38,33.05 10.38,39.72 10,40.1 10,42.29 13.43,45.72 JP1.2
VCC
  Top 0.178: JP1.4 4.1,41.43 4.1,40.86 R2.P$2 4,40.77 4,38.86 2.38,37.24 2.38,29.15 3.52,28 4.19,28 5,28.81 | C13.1 22.95,18.67 21.14,16.86 LED1.A | U1.4 5.62,31.34 5.24,31.72 4.76,31.72 4.1,31.05 4.1,30.77 4.48,30.38 4.48,30.19 U1.6 4.57,30.1 4.95,29.72 4.95,28.86 5,28.81 | 5,28.81 10,23.81 10,23.53 U1.18 10.1,23.43 10.1,23.15 13.81,19.43 13.81,18.57 14.48,17.91 15.43,17.91 17.33,19.81 17.33,20.48 C3.2 17.43,20.57 18.72,21.86 | 18.72,21.86 18.76,21.91 20.48,21.91 U2.5 | C10.1 16.38,29.24 16.38,28.1 18.67,25.81 18.67,21.91 18.72,21.86
  Bottom 0.178: LED1.A 21.05,16.86 17.43,20.48 C3.2

### Text on the board
tPlace: BLK | GRN
tValues: Valid combinations: | 168V / 3.3V Reg / 8MHz | 168 / 5V Reg / 16MHz | 168 / 5V Reg / 20MHz | Mark back accordingly | Arduino Pro Mini